# EAGLE schematic HighAcc (EAGLE 6.2)
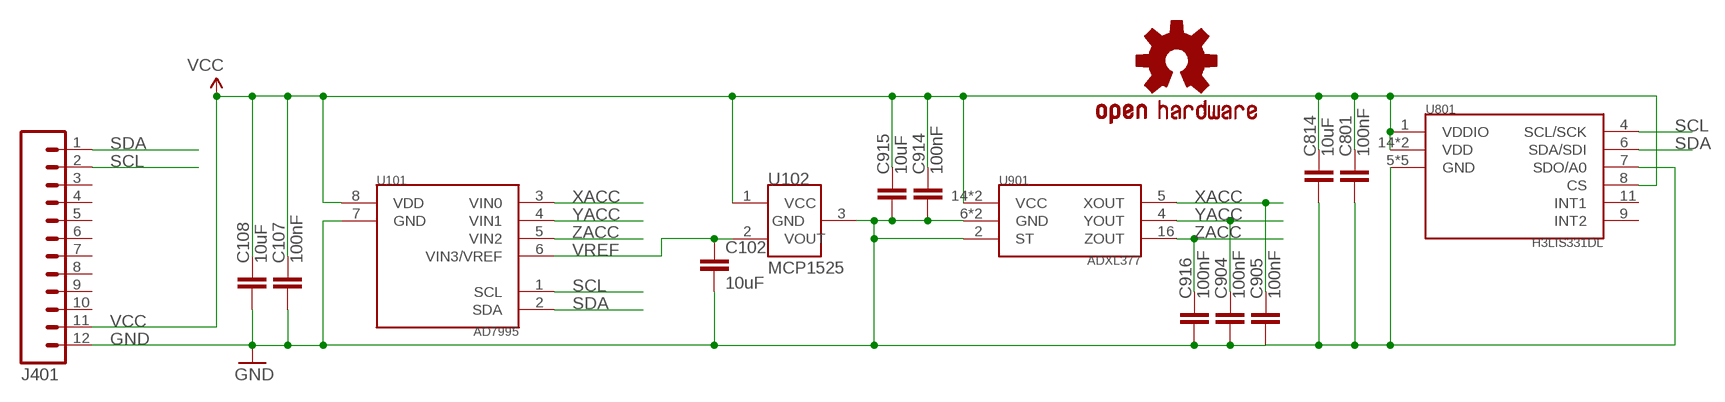
[diagram p0: schematic, sheet 1]

## Parts
C102  10uF  CAP0603-CAP  [0603-CAP]
C107  100nF  CAP0603-CAP  [0603-CAP]
C108  10uF  CAP0603-CAP  [0603-CAP]
C801  100nF  CAP0603-CAP  [0603-CAP]
C814  10uF  CAP0603-CAP  [0603-CAP]
C904  100nF  CAP0603-CAP  [0603-CAP]
C905  100nF  CAP0603-CAP  [0603-CAP]
C914  100nF  CAP0603-CAP  [0603-CAP]
C915  10uF  CAP0603-CAP  [0603-CAP]
C916  100nF  CAP0603-CAP  [0603-CAP]
J401  M12PTH  [1X12]
U101  AD7995  AD799X  [SOT-23-8]
U102  MCP1525  [SOT-23-3]
U801  H3LIS331DL  [LLGA16]
U901  ADXL377  [ADXL377]
U$2  OSHW-LOGOS  [OSHW-LOGO-S]

## Nets
GND: C102.2 C107.2 C108.2 C801.2 C814.2 C904.2 C905.2 C914.2 C915.2 C916.2 J401.12 U101.7(GND) U102.3(GND) U801.5(GND) U801.7(SDO/A0) U801.10(GND) U801.12(GND) U801.13(GND) U801.16(GND) U901.2(ST) U901.6(GND) U901.7(GND)
SCL: J401.2 U101.1(SCL) U801.4(SCL/SCK)
SDA: J401.1 U101.2(SDA) U801.6(SDA/SDI)
VCC [POWER]: C107.1 C108.1 C801.1 C814.1 C914.1 C915.1 J401.11 U101.8(VDD) U102.1(VCC) U801.1(VDDIO) U801.8(CS) U801.14(VDD) U801.15(VDD) U901.14(VCC) U901.15(VCC)
VREF: C102.1 U101.6(VIN3/VREF) U102.2(VOUT)
XACC: C905.1 U101.3(VIN0) U901.5(XOUT)
YACC: C904.1 U101.4(VIN1) U901.4(YOUT)
ZACC: C916.1 U101.5(VIN2) U901.16(ZOUT)
Unconnected: J401.3 J401.4 J401.5 J401.6 J401.7 J401.8 J401.9 J401.10 U801.9(INT2) U801.11(INT1)

## Library data of the parts
C102 C108 C814 C915 = SparkFun:CAP: Capacitor Standard 0603 ceramic capacitor, and 0.1" leaded capacitor.; DIGIKEY: 445-7486-1-ND
C107 C801 C904 C905 C914 C916 = SparkFun:CAP: Capacitor Standard 0603 ceramic capacitor, and 0.1" leaded capacitor.; DIGIKEY: 445-1316-1-ND
J401 = SparkFun:M12: Header 12 Standard 12-pin 0.1" header. Use with straight break away headers (SKU : PRT-00116), right angle break away headers (PRT-00553), swiss pins (PRT-00743), machine pins (PRT-00117), and female headers (PRT-00115).; DIGIKEY: $NOPART
U101 = KwanSystems:AD799X
U102 = KwanSystems:MCP1525
U801 = KwanSystems:H3LIS331DL
U901 = KwanSystems:ADXL377
U$2 = SparkFun:OSHW-LOGO: Open Source Hardware Logo This logo indicates the piece of hardware it is found on incorporates a OSHW license and/or adheres to the definition of open source hardware found here: http://freedomdefined.org/OSHW; DIGIKEY: $NOPART

## Net classes
0 default: width 0.152 mm, drill 0.33 mm, clearance 0.152 mm
1 POWER: width 0.152 mm, drill 0.33 mm, clearance 0.152 mm
2 hv: width 0.152 mm, drill 0.33 mm, clearance 0.152 mm